# EAGLE design 2045 (EAGLE 7.2.0)
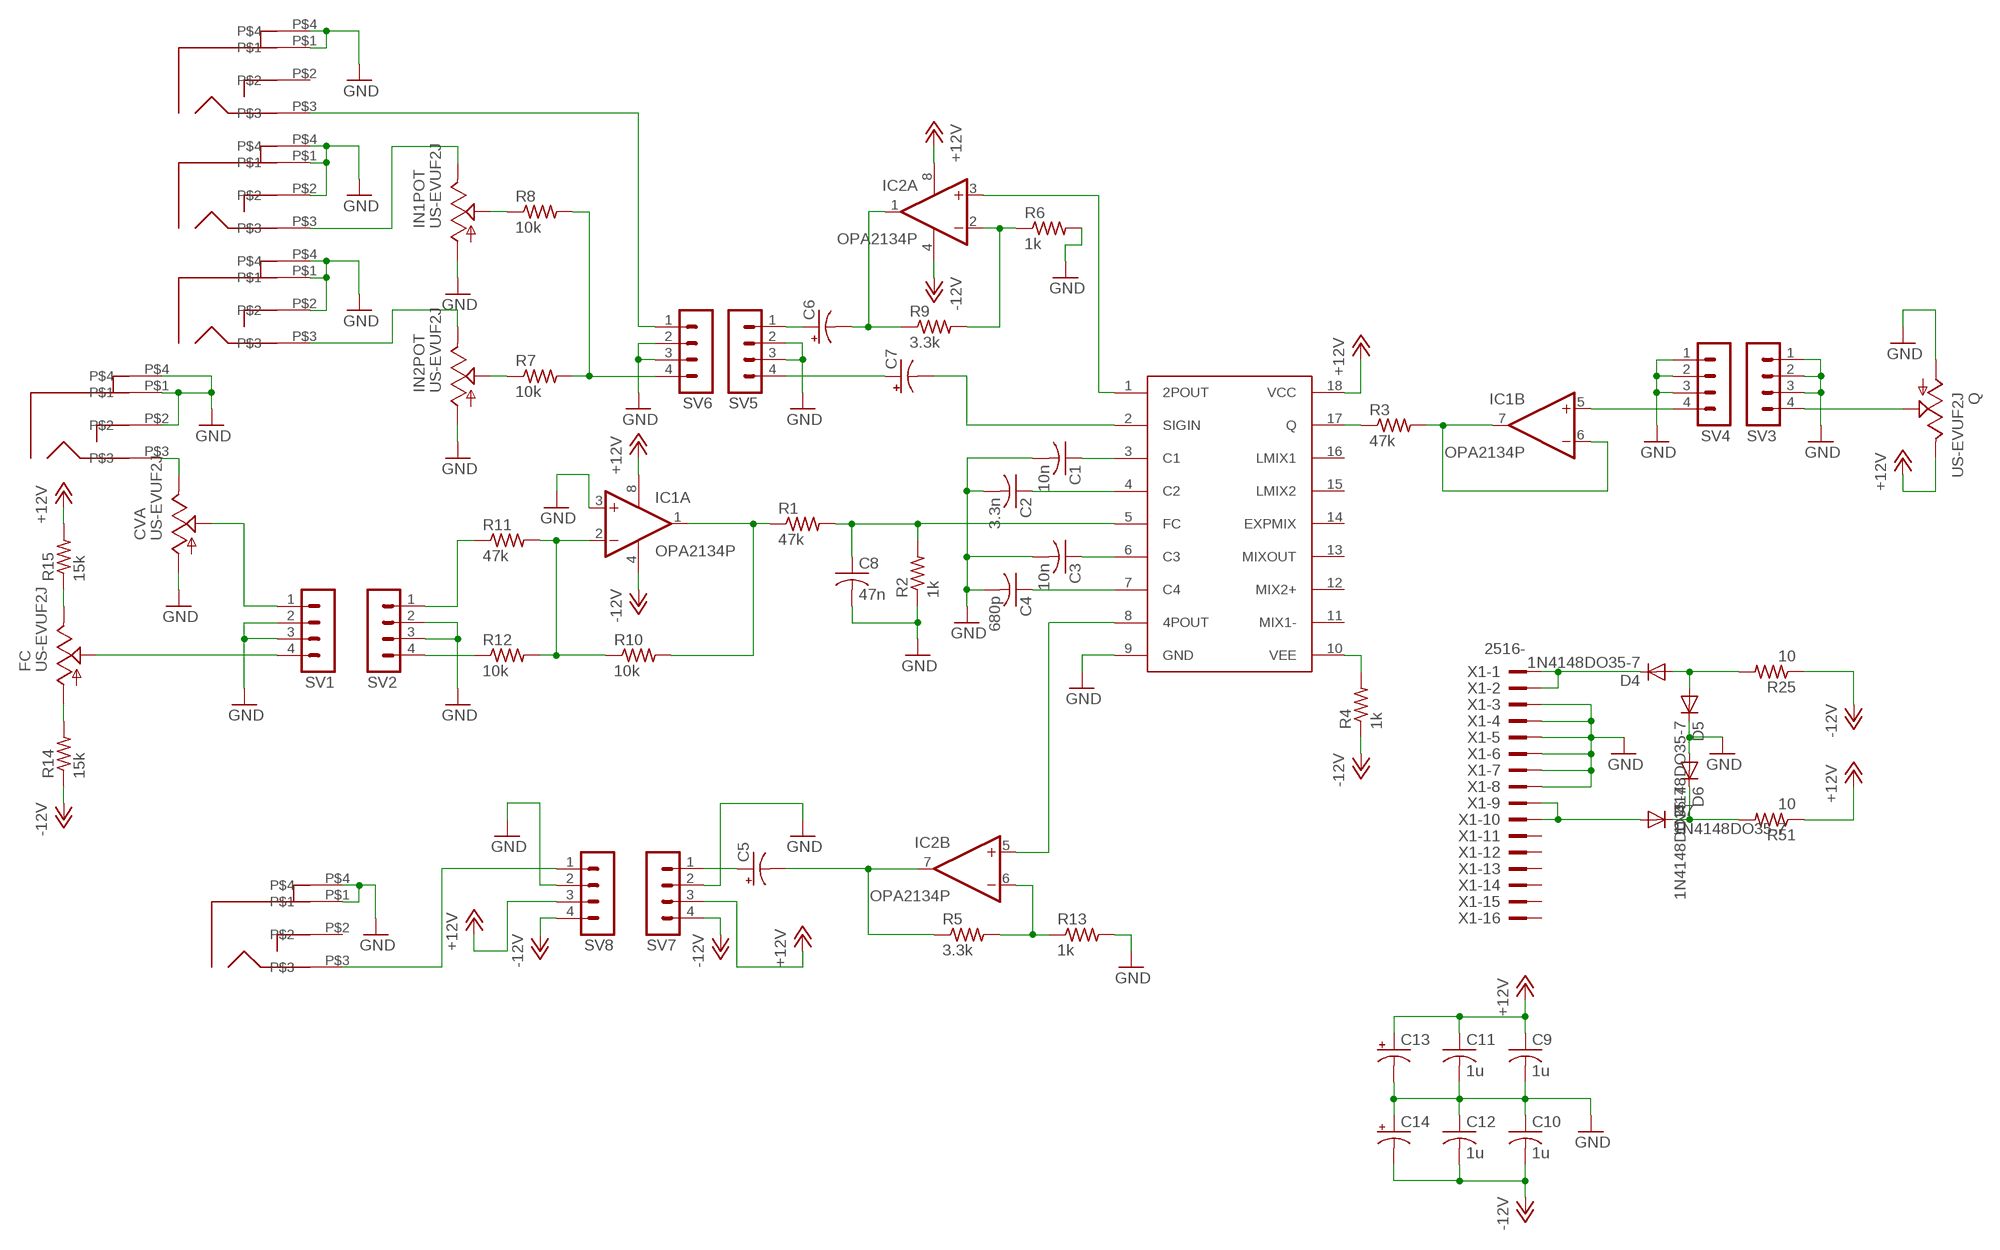
[diagram p0: schematic, sheet 1]

## Parts
2POUT  PJ301BM  [PJ301BM]
4POUTPUT  PJ301BM  [PJ301BM]
C1  10n  C-US050-025X075  [C050-025X075]
C2  3.3n  C-US050-025X075  [C050-025X075]
C3  10n  C-US050-025X075  [C050-025X075]
C4  680p  C-US050-025X075  [C050-025X075]
C5  CPOL-USE2.5-7  [E2,5-7]
C6  CPOL-USE2.5-7  [E2,5-7]
C7  CPOL-USE2.5-7  [E2,5-7]
C8  47n  C-US050-025X075  [C050-025X075]
C9  1u  C-US050-025X075  [C050-025X075]
C10  1u  C-US050-025X075  [C050-025X075]
C11  1u  C-US050-025X075  [C050-025X075]
C12  1u  C-US050-025X075  [C050-025X075]
C13  CPOL-USE2.5-7  [E2,5-7]
C14  CPOL-USE2.5-7  [E2,5-7]
CVA  US-EVUF2J  [EVUFXJ]
CVIN  PJ301BM  [PJ301BM]
D4  1N4148DO35-7  [DO35-7]
D5  1N4148DO35-7  [DO35-7]
D6  1N4148DO35-7  [DO35-7]
D7  1N4148DO35-7  [DO35-7]
FC  US-EVUF2J  [EVUFXJ]
IC1  OPA2134P  [DIL08]
IC2  OPA2134P  [DIL08]
IN  PJ301BM  [PJ301BM]
IN1POT  US-EVUF2J  [EVUFXJ]
IN2  PJ301BM  [PJ301BM]
IN2POT  US-EVUF2J  [EVUFXJ]
Q  US-EVUF2J  [EVUFXJ]
R1  47k  R-US_0204/7  [0204/7]
R2  1k  R-US_0204/7  [0204/7]
R3  47k  R-US_0204/7  [0204/7]
R4  1k  R-US_0204/7  [0204/7]
R5  3.3k  R-US_0204/7  [0204/7]
R6  1k  R-US_0204/7  [0204/7]
R7  10k  R-US_0204/7  [0204/7]
R8  10k  R-US_0204/7  [0204/7]
R9  3.3k  R-US_0204/7  [0204/7]
R10  10k  R-US_0204/7  [0204/7]
R11  47k  R-US_0204/7  [0204/7]
R12  10k  R-US_0204/7  [0204/7]
R13  1k  R-US_0204/7  [0204/7]
R14  15k  R-US_0204/7  [0204/7]
R15  15k  R-US_0204/7  [0204/7]
R25  10  R-US_0207/2V  [0207/2V]
R51  10  R-US_0207/2V  [0207/2V]
SV1  MA04-1  [MA04-1]
SV2  MA04-1  [MA04-1]
SV3  MA04-1  [MA04-1]
SV4  MA04-1  [MA04-1]
SV5  MA04-1  [MA04-1]
SV6  MA04-1  [MA04-1]
SV7  MA04-1  [MA04-1]
SV8  MA04-1  [MA04-1]
U$1  SSM2045  [DIL18]
X1  2516-  [PAK100/2500-16]

## Nets
+12V: C9.1 C11.1 C13.+ IC1.8(P:V+) IC2.8(P:V+) Q.3(E) R15.2 R51.1 SV7.3 SV8.3 U$1.18(VCC)
-12V: C10.2 C12.2 C14.- IC1.4(P:V-) IC2.4(P:V-) R4.1 R14.1 R25.1 SV7.4 SV8.4
GND: 2POUT.P$1 2POUT.P$4 4POUTPUT.P$1 4POUTPUT.P$4 C1.2 C2.2 C3.2 C4.2 C8.2 C9.2 C10.1 C11.2 C12.1 C13.- C14.+ CVA.1(A) CVIN.P$1 CVIN.P$2 CVIN.P$4 D5.C D6.A IC1.3(A:+IN) IN1POT.1(A) IN2.P$1 IN2.P$2 IN2.P$4 IN2POT.1(A) IN.P$1 IN.P$2 IN.P$4 Q.1(A) R2.1 R6.2 R13.2 SV1.2 SV1.3 SV2.2 SV2.3 SV3.1 SV3.2 SV3.3 SV4.1 SV4.2 SV4.3 SV5.2 SV5.3 SV6.2 SV6.3 SV7.2 SV8.2 U$1.9(GND) X1.3 X1.4 X1.5 X1.6 X1.7 X1.8
N$1: C1.1 U$1.3(C1)
N$2: C2.1 U$1.4(C2)
N$3: C3.1 U$1.6(C3)
N$4: C4.1 U$1.7(C4)
N$5: FC.2(S) SV1.4
N$6: FC.1(A) R14.2
N$7: FC.3(E) R15.1
N$8: C8.1 R1.2 R2.2 U$1.5(FC)
N$9: R3.1 U$1.17(Q)
N$10: R4.2 U$1.10(VEE)
N$11: IC2.3(A:+IN) U$1.1(2POUT)
N$12: IC2.2(A:-IN) R6.1 R9.2
N$13: IC2.5(B:+IN) U$1.8(4POUT)
N$14: C5.- IC2.7(B:OUT) R5.1
N$15: IN1POT.2(S) R8.1
N$16: C7.- U$1.2(SIGIN)
N$17: R12.1 SV2.4
N$18: IC1.2(A:-IN) R10.1 R11.2 R12.2
N$19: IC1.1(A:OUT) R1.1 R10.2
N$20: IC1.6(B:-IN) IC1.7(B:OUT) R3.2
N$21: R11.1 SV2.1
N$22: CVA.3(E) CVIN.P$3
N$23: Q.2(S) SV3.4
N$24: C7.+ SV5.4
N$25: C6.+ SV5.1
N$26: 2POUT.P$3 SV6.1
N$27: R7.2 R8.2 SV6.4
N$28: C5.+ SV7.1
N$29: IN2POT.2(S) R7.1
N$30: IC1.5(B:+IN) SV4.4
N$31: CVA.2(S) SV1.1
N$32: 4POUTPUT.P$3 SV8.1
N$33: IC2.6(B:-IN) R5.2 R13.1
N$34: C6.- IC2.1(A:OUT) R9.1
N$35: IN1POT.3(E) IN.P$3
N$36: IN2.P$3 IN2POT.3(E)
N$37: D6.C D7.C R51.2
N$38: D4.A D5.A R25.2
N$71: D7.A X1.9 X1.10
N$72: D4.C X1.1 X1.2
Unconnected: 2POUT.P$2 4POUTPUT.P$2 U$1.11(MIX1-) U$1.12(MIX2+) U$1.13(MIXOUT) U$1.14(EXPMIX) U$1.15(LMIX2) U$1.16(LMIX1) X1.11 X1.12 X1.13 X1.14 X1.15 X1.16

## Library data of the parts
2POUT 4POUTPUT CVIN IN IN2 = dan:PJ301BM
C1-C4 C8-C12 = dan:C-US: CAPACITOR, American symbol
C5-C7 C13 C14 = dan:CPOL-US: POLARIZED CAPACITOR, American symbol
CVA FC IN1POT IN2POT Q = dan:US-EVU: 9 mm Square Rotary Potentiometers Source: Panasonic
D4-D7 = dan:1N4148: DIODE high speed (Philips)
IC1 IC2 = dan:OPA2134: SoundPLUS (TM) High Performance AUDIO OPERATIONAL AMPLIFIERS Source: http://focus.ti.com/lit/ds/sbos058/sbos058.pdf
R1-R15 R25 R51 = dan:R-US_: RESISTOR, American symbol
SV1-SV8 = dan:MA04-1: PIN HEADER; OC_FARNELL: unknown; OC_NEWARK: unknown
U$1 = dan:SSM2045
X1 = dan:2516-: 3M (TM) Pak 100 4-Wall Header Source: 3M; OC_FARNELL: unknown; OC_NEWARK: unknown

## Board
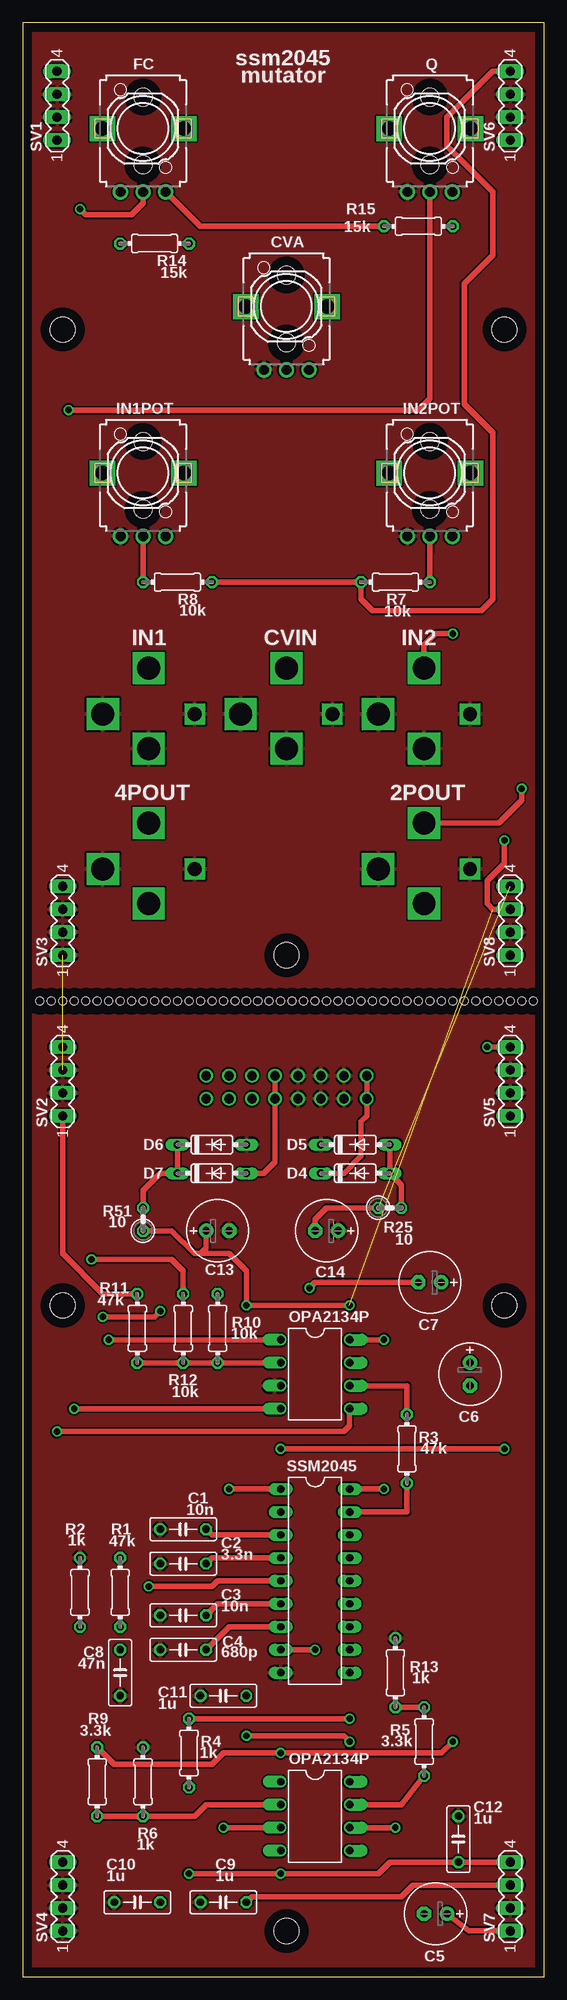
[diagram p1: board, top side]
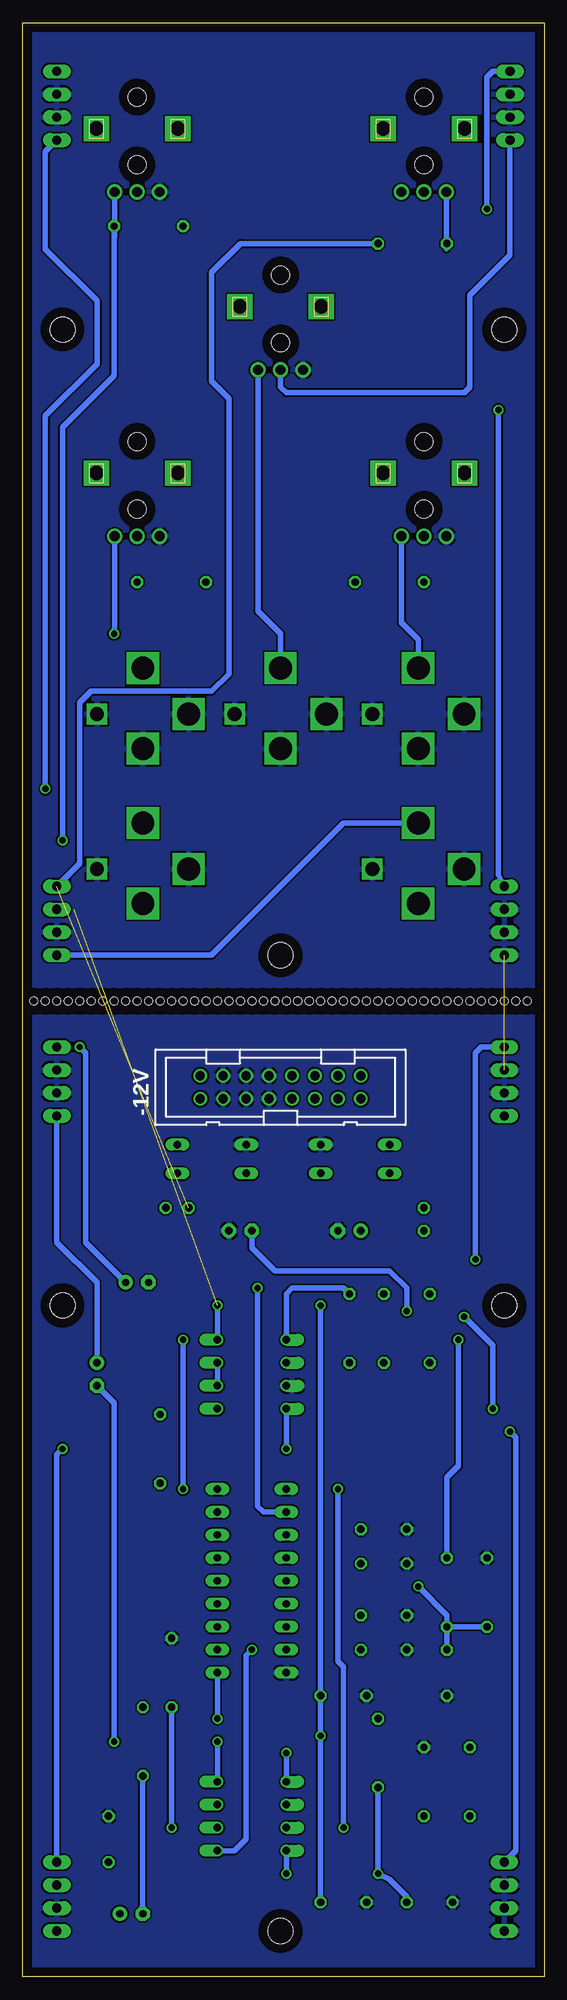
[diagram p2: board, bottom side, seen from below]

Size 57.77 x 216.21 mm. Coordinates in mm from the lower left corner, seen from the top.
Outline: 0,0 57.77,0 57.77,216.21 0,216.21 0,0
Copper layers (1*16): Top 0.035mm / dielectric 1.5mm / Bottom 0.035mm
Design rules "default": minimum track width 10mil, minimum drill 24mil, track to track 8mil, track to pad 8mil, pad to pad 8mil, via to via 8mil, smd to smd 8mil, copper to edge 40mil, drill to drill 8mil, minimum pad ring 10mil, minimum via ring 8mil, stop-mask expansion 4mil, vias tented up to drill 0mil, thermal gap 10mil
Holes 0.9 mm at 10.79,107.95 9.53,107.95 8.26,107.95 6.99,107.95 5.71,107.95 4.45,107.95 3.17,107.95 1.91,107.95 12.06,107.95 13.34,107.95 14.61,107.95 15.88,107.95 26.04,107.95 24.77,107.95 23.5,107.95 22.23,107.95 20.95,107.95 19.68,107.95 18.41,107.95 17.14,107.95 27.3,107.95 28.57,107.95 29.84,107.95 31.11,107.95 41.27,107.95 40.01,107.95 38.73,107.95 37.47,107.95 36.2,107.95 34.92,107.95 33.66,107.95 32.38,107.95 42.55,107.95 43.81,107.95 45.09,107.95 46.35,107.95 47.62,107.95 48.9,107.95 50.16,107.95 51.44,107.95 52.7,107.95 53.98,107.95 55.24,107.95 56.52,107.95
Holes 2.8 mm at 4.45,182.25 53.34,182.25 4.45,74.3 53.34,74.3 29.21,5.08 29.21,113.03

### Footprints (pad centres in the part's own frame; a part is rotated, then mirrored left to right if it is on the bottom)
PJ301BM = drill 1.524 square: P$1 5.08,0 | drill 2.54 square: P$2 0,-3.81; P$3 0,5.08; P$4 -5.08,0
C050-025X075 = drill 0.813 octagon: 1 -2.54,0; 2 2.54,0
E2,5-7 = drill 0.813 pad 1.6: + -1.27,0 | drill 0.813 pad 1.6 octagon: - 1.27,0
EVUFXJ = drill 1.1 pad 1.676: 1 -2.5,-7; 2 0,-7; 3 2.5,-7 | drill 1.6 pad 2.8 square: M1 4.5,0; M2 -4.5,0 | hole 2: 0,3.5; 0,-4
DO35-7 = drill 0.813 long: A 3.81,0; C -3.81,0
DIL08 = drill 0.813 offset: 1 -3.81,-3.81; 2 -1.27,-3.81; 3 1.27,-3.81; 4 3.81,-3.81; 5 3.81,3.81; 6 1.27,3.81; 7 -1.27,3.81; 8 -3.81,3.81
0204/7 = drill 0.813 octagon: 1 -3.81,0; 2 3.81,0
0207/2V = drill 0.813 octagon: 1 -1.27,0; 2 1.27,0
MA04-1 = drill 1.016 long: 1 -3.81,0; 2 -1.27,0; 3 1.27,0; 4 3.81,0
DIL18 = drill 0.813 long: 1 -10.16,-3.81; 2 -7.62,-3.81; 3 -5.08,-3.81; 4 -2.54,-3.81; 5 0,-3.81; 6 2.54,-3.81; 7 5.08,-3.81; 8 7.62,-3.81; 9 10.16,-3.81; 10 10.16,3.81; 11 7.62,3.81; 12 5.08,3.81; 13 2.54,3.81; 14 0,3.81; 15 -2.54,3.81; 16 -5.08,3.81; 17 -7.62,3.81; 18 -10.16,3.81
PAK100/2500-16 = drill 1 pad 1.422: 1 -8.89,-1.27; 2 -8.89,1.27; 3 -6.35,-1.27; 4 -6.35,1.27; 5 -3.81,-1.27; 6 -3.81,1.27; 7 -1.27,-1.27; 8 -1.27,1.27; 9 1.27,-1.27; 10 1.27,1.27; 11 3.81,-1.27; 12 3.81,1.27; 13 6.35,-1.27; 14 6.35,1.27; 15 8.89,-1.27; 16 8.89,1.27

### Placement (x,y rotation side)
2POUT  44.45,122.56 0 top
4POUTPUT  13.97,122.56 0 top
C1  17.78,49.53 180 top
C2  17.78,45.72 180 top
C3  17.78,40.01 180 top
C4  17.78,36.2 180 top
C5  45.72,6.99 180 top
C6  49.53,66.67 270 top
C7  45.09,76.83 180 top
C8  10.79,33.66 270 top
C9  22.23,8.26 180 top
C10  12.7,8.26 0 top
C11  22.23,31.11 180 top
C12  48.26,15.24 270 top
C13  21.59,82.55 0 top
C14  33.66,82.55 180 top
CVA  29.21,184.78 0 top
CVIN  29.21,139.7 0 top
D4  36.83,88.9 0 top
D5  36.83,92.08 0 top
D6  20.95,92.08 0 top
D7  20.95,88.9 0 top
FC  13.34,204.47 0 top
IC1  32.38,66.67 270 top
IC2  32.38,17.78 270 top
IN  13.97,139.7 0 top
IN1POT  13.34,166.37 0 top
IN2  44.45,139.7 0 top
IN2POT  45.09,166.37 0 top
Q  45.09,204.47 0 top
R1  10.79,42.55 270 top
R2  6.35,42.55 270 top
R3  42.55,58.42 90 top
R4  18.41,24.77 90 top
R5  44.45,26.04 90 top
R6  13.34,21.59 90 top
R7  41.27,154.31 180 top
R8  17.14,154.31 0 top
R9  8.26,21.59 270 top
R10  21.59,71.75 90 top
R11  12.7,71.75 270 top
R12  17.78,71.75 270 top
R13  41.27,33.66 90 top
R14  14.61,191.77 180 top
R15  43.81,193.68 0 top
R25  40.64,85.09 0 top
R51  13.34,83.82 90 top
SV1  3.81,207.01 90 top
SV2  4.45,99.06 90 top
SV3  4.45,116.84 90 top
SV4  4.45,8.89 90 top
SV5  53.98,99.06 90 top
SV6  53.98,207.01 90 top
SV7  53.98,8.89 90 top
SV8  53.98,116.84 90 top
U$1  32.38,43.81 270 top
X1  29.21,98.42 0 bottom

### Tracks (layer width: path | path; a pad name or v marks a point on that pad's centre or on a via)
+12V  (via drill 0.7)  (1 unrouted)
  Top 0.61: U$1.18 v40.01,53.98 | v40.01,70.48 IC1.8 | v24.77,26.67 35.56,26.67 v36.2,26.04 | v36.2,74.3 v24.77,74.3 24.77,78.11 22.86,80.01 19.68,80.01 | C9.1 25.4,8.89 41.91,8.89 43.18,10.16 SV7.3 | 19.68,80.01 19.05,80.01 16.51,82.55 R51.1 | C13.+ 20.32,80.64 19.68,80.01 | SV8.3 52.07,118.11 51.44,118.75 51.44,121.28 53.34,123.19 v53.34,125.73
  Bottom 0.61: v24.77,74.3 C11.1 v24.77,26.67 C9.1 | v40.01,53.98 v40.01,70.48 | v36.2,26.04 IC2.8 | IC1.8 v36.2,74.3 | Q.3 47.59,192.44 R15.2 47.62,177.16 53.34,171.45 v53.34,125.73
-12V  (via drill 0.7)  (1 unrouted)
  Top 0.61: v18.41,11.43 v28.57,11.43 39.37,11.43 40.64,12.7 C12.2 SV7.4 | v53.34,58.42 v28.57,58.42 | IC1.4 v5.71,62.87 | v8.89,73.03 14.61,73.03 v15.24,73.66 | R25.1 33.66,85.09 32.38,83.82 C14.-
  Bottom 0.61: R4.1 v18.41,11.43 17.14,10.79 15.24,8.89 C10.2 | SV7.4 53.98,57.78 v53.34,58.42 | v28.57,58.42 IC1.4 | v5.71,62.87 5.71,69.85 v8.89,73.03 | IC2.4 v28.57,11.43 | v15.24,73.66 15.24,76.2 17.14,78.11 29.84,78.11 32.38,80.64 C14.- | SV8.4 51.44,123.19 51.44,140.97 50.16,142.24 36.83,142.24 34.92,144.15 34.92,174.62 36.83,176.53 36.83,188.59 33.66,191.77 R14.1
GND  (1 unrouted)
  pour Top: -1.27,218.44 60.33,218.44 60.33,-2.54 -1.91,-2.54 -1.91,217.81
  pour Bottom: -3.17,222.25 62.87,222.25 62.87,-5.08 -3.17,-5.08
N$1
  Top 0.61: U$1.3 20.95,48.9 C1.1
N$2
  Top 0.61: U$1.4 20.95,46.35 C2.1
N$3
  Top 0.61: U$1.6 21.59,41.27 C3.1
N$4
  Top 0.61: U$1.7 22.86,38.73 C4.1
N$5  (via drill 0.7)
  Top 0.61: v6.35,195.58 6.99,194.94 12.06,194.94 13.34,196.22 FC.2
  Bottom 0.61: v6.35,195.58 6.35,210.19 5.71,210.82 SV1.4
N$6
  Bottom 0.61: FC.1 10.84,191.18 R14.2
N$7
  Top 0.61: FC.3 19.67,193.66 R15.1
N$8  (via drill 0.7)
  Top 0.61: U$1.5 21.59,43.81 20.95,43.18 v13.97,43.18
  Bottom 0.61: R1.2 C8.1 | R2.2 R1.2 | R1.2 10.79,40.01 v13.97,43.18
N$9
  Top 0.61: U$1.17 42.55,51.44 R3.1
N$10  (via drill 0.7)
  Top 0.61: v36.2,28.57 R4.2
  Bottom 0.61: v36.2,28.57 U$1.10
N$11  (via drill 0.7)
  Top 0.61: IC2.3 v22.23,16.51 | v22.86,53.98 U$1.1
  Bottom 0.61: v22.23,16.51 22.23,34.29 22.86,34.92 v22.86,53.98
N$12
  Top 0.61: R9.2 R6.1 19.05,17.78 20.32,19.05 IC2.2
N$13  (via drill 0.7)
  Top 0.61: v32.38,36.2 U$1.8
  Bottom 0.61: IC2.5 34.29,13.97 33.02,15.24 33.02,35.56 v32.38,36.2
N$14
  Top 0.61: IC2.7 41.91,19.05 R5.1
  Bottom 0.61: C5.- R5.1
N$15
  Top 0.61: R8.1 IN1POT.2
N$16  (via drill 0.7)
  Top 0.61: C7.- 32.38,76.83 v31.75,76.2
  Bottom 0.61: v31.75,76.2 31.75,52.07 31.11,51.44 U$1.2
N$17  (via drill 0.7)
  Top 0.61: R12.1 17.78,78.11 16.51,79.38 v7.62,79.38
  Bottom 0.61: v7.62,79.38 7.62,102.23 6.99,102.87 SV2.4
N$18
  Top 0.61: IC1.2 R10.1 R12.2 R11.2
N$19  (via drill 0.7)
  Top 0.61: IC1.1 v9.53,70.48
  Bottom 0.61: v9.53,70.48 9.53,56.52 10.79,55.24 R1.1 | IC1.1 28.57,75.56 27.94,76.2 22.23,76.2 R10.2
N$20
  Top 0.61: IC1.6 42.55,65.41 R3.2
  Bottom 0.61: IC1.6 IC1.7
N$21
  Top 0.61: SV2.1 4.45,80.01 8.89,75.56 R11.1
N$22
  Bottom 0.61: CVA.3 31.71,151.09 29.21,148.59 CVIN.P$3
N$23  (via drill 0.7)
  Top 0.61: v5.08,173.35 43.81,173.35 45.09,174.62 Q.2
  Bottom 0.61: v5.08,173.35 5.08,121.92 SV3.4
N$24  (via drill 0.7)
  Top 0.61: v51.44,102.87 SV5.4
  Bottom 0.61: C7.+ 50.8,81.28 50.8,102.23 v51.44,102.87
N$25
  Bottom 0.61: C6.+ 49.53,76.83 53.98,81.28 SV5.1
N$26  (via drill 0.7)
  Top 0.61: 2POUT.P$3 52.7,127.64 55.24,130.18 v55.24,131.44
  Bottom 0.61: SV6.1 55.24,201.93 55.24,191.13 49.53,185.42 49.53,178.44 55.24,172.72 v55.24,131.44
N$27
  Top 0.61: R8.2 R7.2 37.47,152.4 38.73,151.13 50.8,151.13 52.07,152.4 52.07,170.81 48.9,173.99 48.9,187.32 52.07,190.5 52.07,197.49 46.99,202.56 46.99,205.74 52.07,210.82 SV6.4
N$28
  Top 0.61: SV7.1 49.4,5.08 C5.+
N$29
  Top 0.61: 45.09,157.48 IN2POT.2 R7.1
N$30  (via drill 0.7)
  Top 0.61: v3.81,60.33 35.56,60.33 36.2,60.96 IC1.5
  Bottom 0.61: v3.81,60.33 3.17,59.69 3.17,13.97 SV4.4
N$31
  Bottom 0.61: CVA.2 29.21,175.9 28.57,175.26 8.89,175.26 8.26,175.9 8.26,186.06 3.81,190.5 SV1.1
N$32
  Bottom 0.61: SV8.1 36.83,113.03 22.23,127.64 4POUTPUT.P$3
N$33  (via drill 0.7)
  Top 0.61: R13.1 R5.2 | IC2.6 v41.27,16.51
  Bottom 0.61: v41.27,16.51 R13.1
N$34  (via drill 0.7)
  Top 0.61: v47.62,26.04 46.35,24.77 v28.57,24.77 22.23,24.77 20.95,23.5 10.16,23.5 R9.1
  Bottom 0.61: v47.62,26.04 47.62,63.5 C6.- | IC2.1 v28.57,24.77
N$35
  Bottom 0.61: IN1POT.3 15.84,149.82 13.97,147.96 IN.P$3
N$36  (via drill 0.7)
  Top 0.61: IN2.P$3 44.45,147.32 45.72,148.59 v47.62,148.59
  Bottom 0.61: IN2POT.3 47.59,149.9 v47.62,148.59
N$37
  Top 0.61: D6.C D7.C 15.24,88.9 13.34,87 R51.2
N$38
  Top 0.61: D5.A D4.A 41.91,87.63 R25.2
N$71
  Top 0.61: X1.10 X1.9 27.94,90.17 26.67,88.9 D7.A
N$72
  Top 0.61: X1.2 X1.1 38.1,95.25 37.47,94.61 37.47,90.81 35.56,88.9 D4.C

### Text on the board
tPlace: ssm2045 | mutator | IN1 | CVIN | IN2 | 4POUT | 2POUT
bPlace: -12V